# EAGLE design Django (EAGLE 9.6.2)
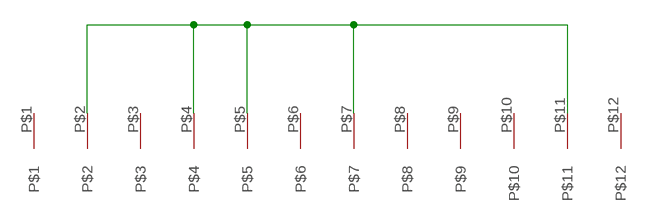
[diagram p0: schematic, sheet 1]

## Parts
U$1  BEAST  [BEAST]

## Nets
N$1: U$1.P$2 U$1.P$4 U$1.P$5 U$1.P$7 U$1.P$11
Unconnected: U$1.P$1 U$1.P$3 U$1.P$6 U$1.P$8 U$1.P$9 U$1.P$10 U$1.P$12

## Library data of the parts
U$1 = beastpins:BEAST

## Board
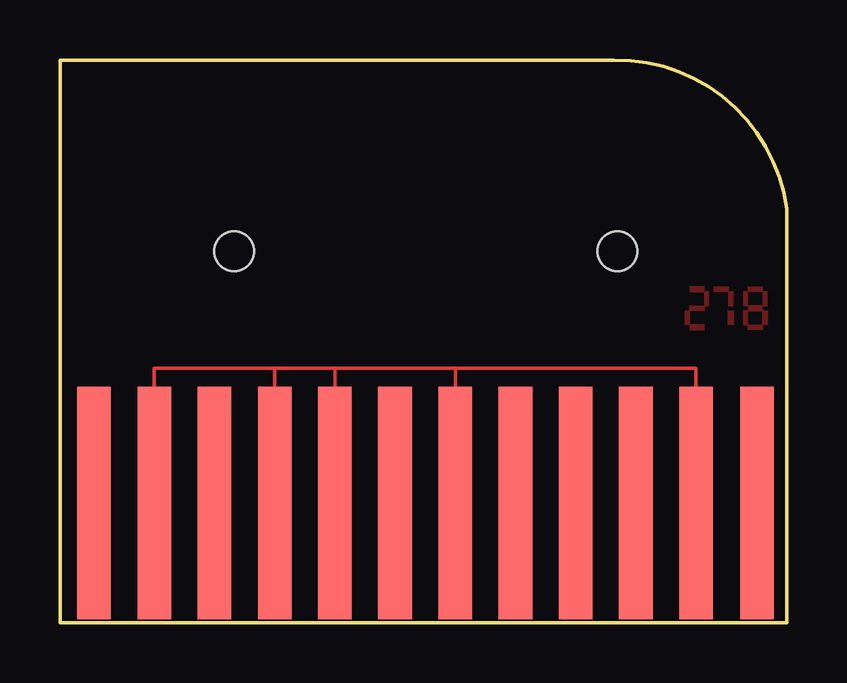
[diagram p1: board, top side]

Size 30.3 x 23.45 mm. Coordinates in mm from the lower left corner, seen from the top.
Outline: 0,0 30.3,0 30.3,17.25 arc83 23.1,23.45 0,23.45 0,0
Copper layers (1*16): Top 0.035mm / dielectric 1.5mm / Bottom 0.035mm
Design rules "default *": minimum track width 6mil, minimum drill 0.35mm, track to track 1mil, track to pad 6mil, pad to pad 6mil, via to via 6mil, smd to smd 6mil, copper to edge 0.002540625mm, drill to drill 1mil, minimum pad ring 10mil, minimum via ring 8mil, stop-mask expansion 4mil, vias tented up to drill 0mil, thermal gap 10mil
Holes 1.65 mm at 7.27,15.49 23.23,15.49

### Footprints (pad centres in the part's own frame; a part is rotated, then mirrored left to right if it is on the bottom)
BEAST = smd 1.4 x 9.7: P$1 -27.61,5.02; P$2 -25.1,5.02; P$3 -22.59,5.02; P$4 -20.08,5.02; P$5 -17.57,5.02; P$6 -15.06,5.02; P$7 -12.55,5.02; P$8 -10.04,5.02; P$9 -7.53,5.02; P$10 -5.02,5.02; P$11 -2.51,5.02; P$12 0.03,5.02

### Placement (x,y rotation side)
U$1  29.03,-0.03 0 top

### Tracks (layer width: path | path; a pad name or v marks a point on that pad's centre or on a via)
N$1
  Top 0.152: 3.93,10.6 4,10.6 | 4,10.6 8.92,10.6 | 8.92,10.6 11.44,10.6 | 11.44,10.6 16.5,10.6 | 16.5,10.6 26.45,10.6 | 26.45,10.6 26.52,10.6 | U$1.P$2 3.93,10.54 4,10.6 | U$1.P$11 26.52,10.53 26.45,10.6 | U$1.P$4 8.95,10.57 8.92,10.6 | U$1.P$5 11.46,10.58 11.44,10.6 | U$1.P$7 16.48,10.58 16.5,10.6
N$2
  pour Top: 28.69,13.21 28.69,13.01 29.28,13.01 29.28,13.21
N$3
  pour Top: 29.3,13.8 29.3,13.21 29.48,13.21 29.48,13.8
N$4
  pour Top: 29.28,13.8 28.69,13.8 28.69,14 29.28,14
N$5
  pour Top: 27.87,13.8 27.28,13.8 27.28,14 27.87,14
N$6
  pour Top: 26.87,13.8 26.87,13.21 27.06,13.21 27.06,13.8
N$7
  pour Top: 26.86,13.01 26.27,13.01 26.27,13.21 26.86,13.21
N$8
  pour Top: 29.48,12.42 29.3,12.42 29.3,13.01 29.48,13.01
N$9
  pour Top: 29.28,12.22 28.69,12.22 28.69,12.42 29.28,12.42
N$10
  pour Top: 28.49,13.01 28.49,12.42 28.68,12.42 28.68,13.01
N$11
  pour Top: 26.27,12.42 26.27,12.22 26.86,12.22 26.86,12.42
N$12
  pour Top: 26.25,12.42 26.07,12.42 26.07,13.01 26.25,13.01
N$18
  pour Top: 26.27,14 26.27,13.8 26.86,13.8 26.86,14
N$21
  pour Top: 28.07,12.42 27.87,12.42 27.87,13.01 28.07,13.01
N$25
  pour Top: 27.87,13.8 27.87,13.21 28.07,13.21 28.07,13.8
N$40
  pour Top: 28.49,13.8 28.49,13.21 28.68,13.21 28.68,13.8